# EAGLE design i2c_adc_avr (EAGLE 6.3)
DATABASE: ./../../eagle/PARTSDB.TXT
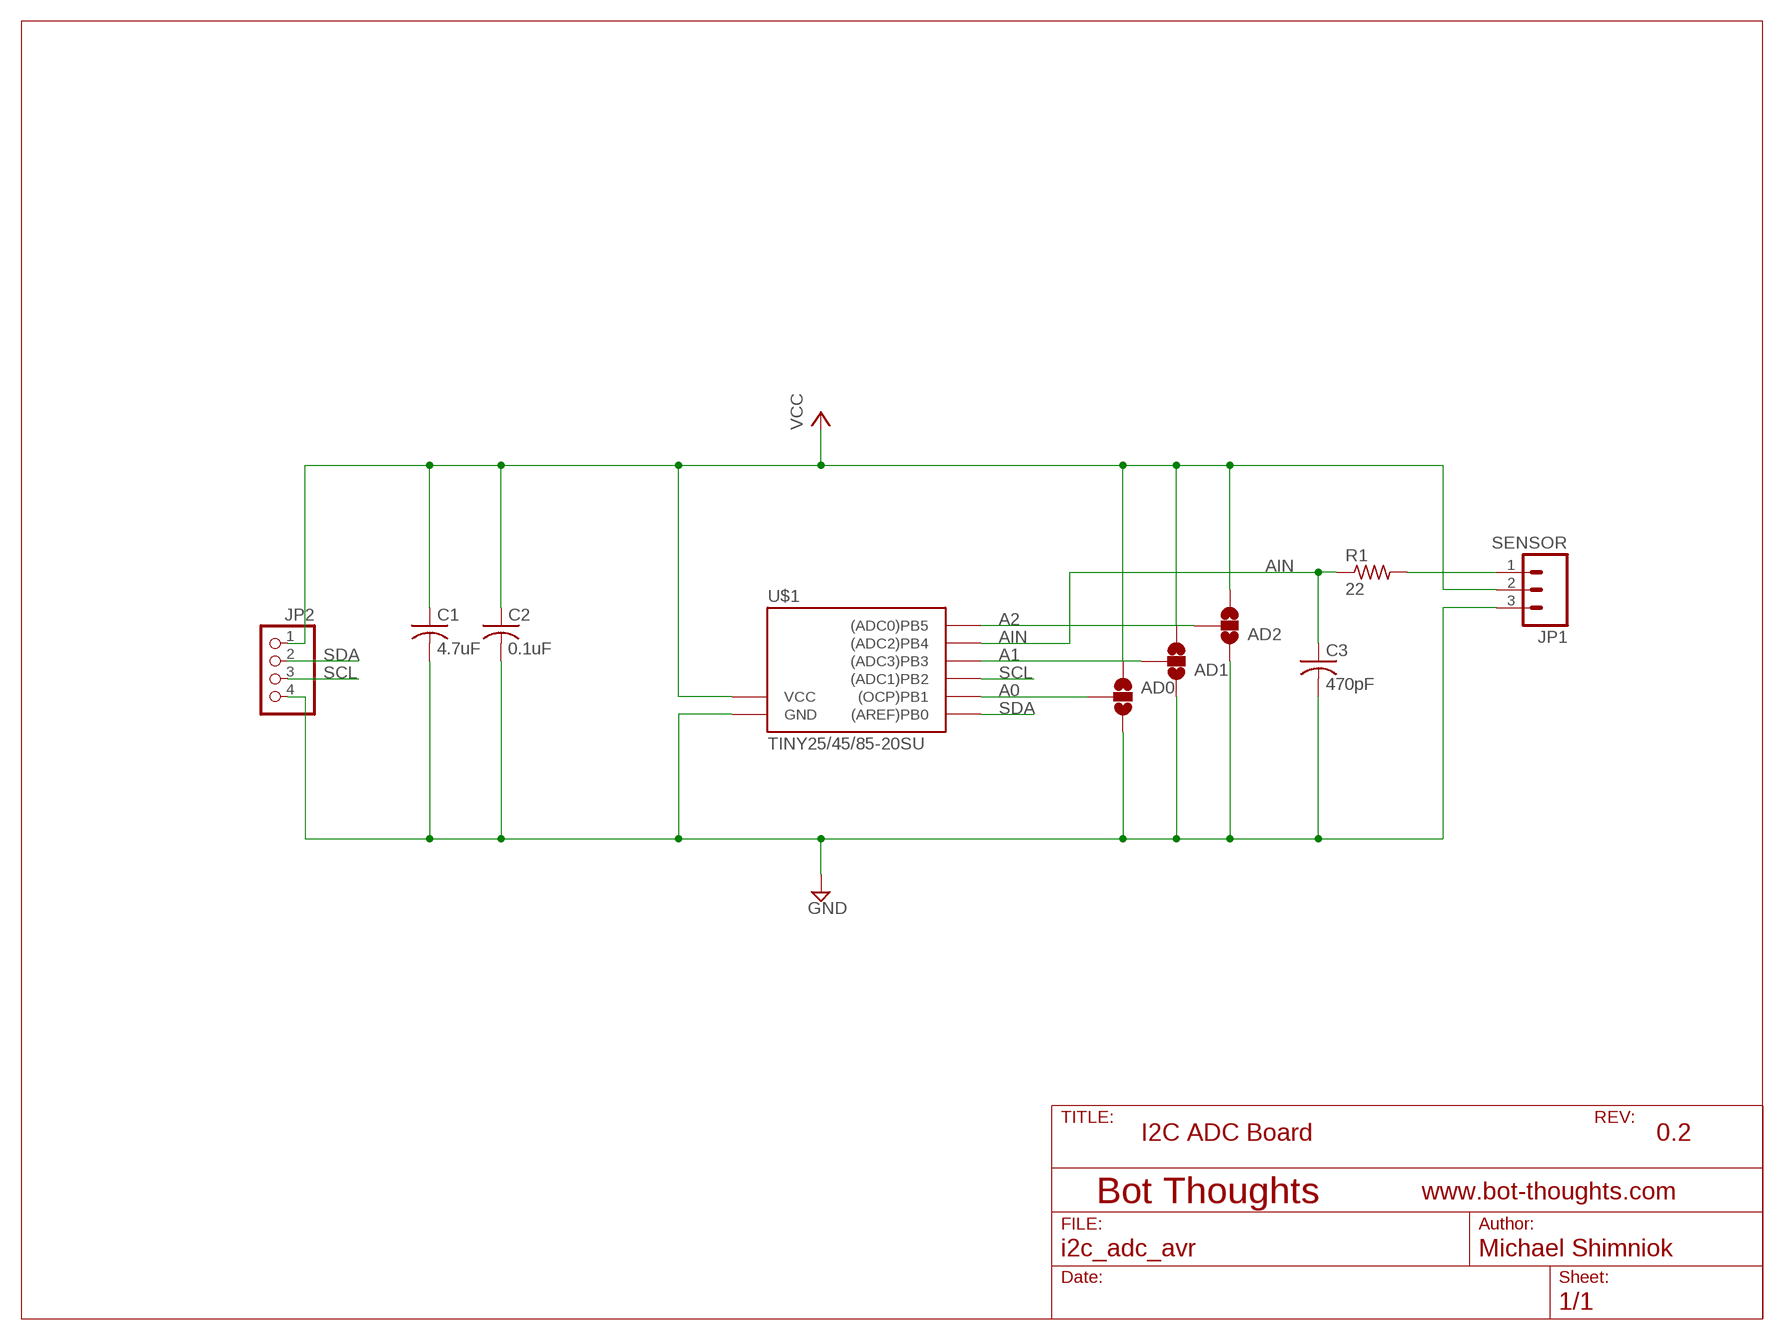
[diagram p0: schematic, sheet 1]

## Parts
AD0  SOLDERJUMPER_2WAYS  [SJ_3]
AD1  SOLDERJUMPER_2WAYS  [SJ_3]
AD2  SOLDERJUMPER_2WAYS  [SJ_3]
C1  4.7uF  C-USC0603  [C0603]
C2  0.1uF  C-USC0603  [C0603]
C3  470pF  C-USC0603  [C0603]
JP1  SENSOR  M03PTH  [1X03]
JP2  PINHD-1X04_2.54-S  [1X04-S]
R1  22  R-US_R0603  [R0603]
U$1  TINY25/45/85-20SU  [SOIC8]

## Nets
A0: AD0.2 U$1.6((OCP)PB1)
A1: AD1.2 U$1.2((ADC3)PB3)
A2: AD2.2 U$1.1((ADC0)PB5)
AIN: C3.1 R1.1 U$1.3((ADC2)PB4)
GND: AD0.3 AD1.1 AD2.1 C1.2 C2.2 C3.2 JP1.3 JP2.4 U$1.4(GND)
N$1: JP1.1 R1.2
SCL: JP2.3 U$1.7((ADC1)PB2)
SDA: JP2.2 U$1.5((AREF)PB0)
VCC: AD0.1 AD1.3 AD2.3 C1.1 C2.1 JP1.2 JP2.1 U$1.8(VCC)

## Notes on the sheet
- I2C ADC Board | 0.2

## Library data of the parts
AD0 AD1 AD2 = SparkFun:SOLDERJUMPER_2WAY: Solder Jumper 2 way solder jumper
C1-C3 = rcl:C-US: CAPACITOR, American symbol
JP1 = SparkFun:M03: Header 3 Standard 3-pin 0.1" header. Use with straight break away headers (SKU : PRT-00116), right angle break away headers (PRT-00553), swiss pins (PRT-00743), machine pins (PRT-00117), and female headers (PRT-00115). Molex polarized connector foot print use with SKU : PRT-08232 with associated crimp pins and housings.
JP2 = pinhead-2:PINHD-1X04: PIN HEADER
R1 = rcl:R-US_: RESISTOR, American symbol
U$1 = mes_avr:TINY25/45/85: Atmel AVR ATiny25,45,85 8-bit Microcontroller

## Board
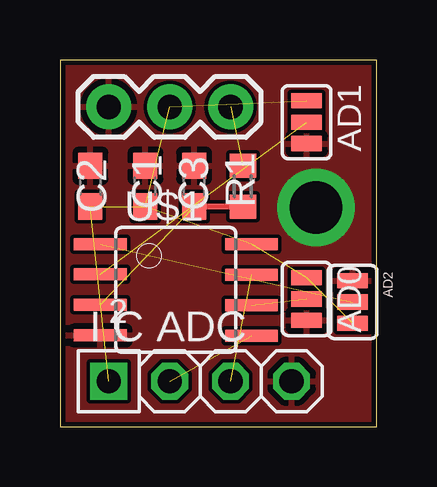
[diagram p1: board, top side]
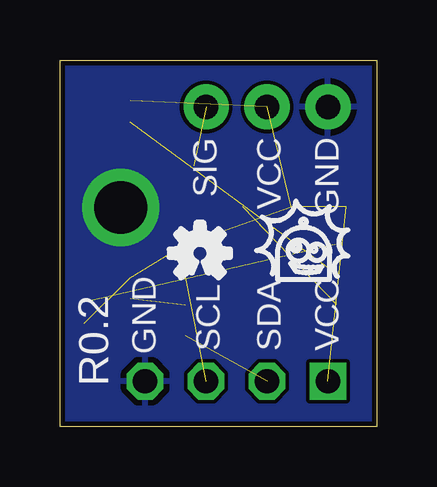
[diagram p2: board, bottom side, seen from below]

Size 13.2 x 15.29 mm. Coordinates in mm from the lower left corner, seen from the top.
Outline: 0,15.29 0,0 13.2,0 13.2,15.29 0,15.29
Copper layers (1*16): Top 0.0356mm / dielectric 1.5011mm / Bottom 0.0356mm
Design rules "default *": minimum track width 6mil, minimum drill 13mil, track to track 6mil, track to pad 6mil, pad to pad 6mil, via to via 6mil, smd to smd 6mil, copper to edge 8mil, drill to drill 6mil, minimum pad ring 7mil, minimum via ring 7mil, stop-mask expansion 4mil, vias tented up to drill 20mil, thermal gap 10mil

### Footprints (pad centres in the part's own frame; a part is rotated, then mirrored left to right if it is on the bottom)
SJ_3 = smd 0.635 x 1.27: 1 -0.889,0; 2 0,0; 3 0.889,0
C0603 = smd 1.1 x 1: 1 -0.85,0; 2 0.85,0
1X03 = drill 1.016 pad 1.88: 1 0,0; 2 2.54,0; 3 5.08,0
1X04-S = drill 1.016 square: 1 -3.81,0 | drill 1.016 octagon: 2 -1.27,0; 3 1.27,0; 4 3.81,0
R0603 = smd 1 x 1.1: 1 -0.85,0; 2 0.85,0
SOIC8 = smd 0.5 x 2.2: 1 -1.905,-3.154; 2 -0.645,-3.154; 3 0.625,-3.154; 4 1.895,-3.154; 5 1.905,3.154; 6 0.635,3.154; 7 -0.635,3.154; 8 -1.905,3.154

### Placement (x,y rotation side)
AD0  10.28,5.33 270 top
AD1  10.28,12.7 90 top
AD2  12.19,5.21 270 top
C1  3.56,10.03 90 top
C2  1.27,10.03 90 top
C3  5.59,10.03 90 top
JP1  7.11,13.34 180 top
JP2  5.84,1.91 0 top
R1  7.62,10.03 90 top
U$1  4.83,5.72 270 top

### Tracks (layer width: path | path; a pad name or v marks a point on that pad's centre or on a via)
A0  (1 unrouted)
A1  (1 unrouted)
A2  (1 unrouted)
AIN  (1 unrouted)
  Top 0.254: R1.1 C3.1
GND  (via drill 2.2)
  other vias: 10.67,9.14
  pour Bottom: 0,15.24 13.21,15.24 13.08,0 -0.13,0
  pour Top: 13.19,15.18 13.19,-0.11 -0.01,-0.11 -0.01,15.18
N$1  (1 unrouted)
SCL  (1 unrouted)
SDA  (1 unrouted)
VCC  (7 unrouted)

### Text on the board
bPlace: R0.2
tNames: I C ADC | 2
bNames: GND | VCC | SIG | VCC | SDA | SCL | GND
_tsilk: AD1 | C2 | C1 | C3 | R1 | U1 | AD0 | I C ADC | 2
_bsilk: GND | VCC | SIG | VCC | SDA | SCL | GND | R0.2